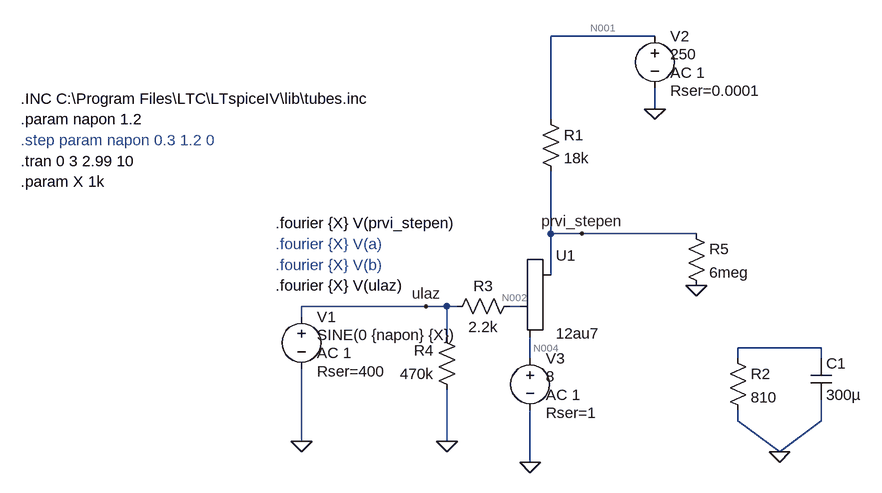
[diagram p0: schematic prvi_etepen.asc]
prvi_etepen.asc, the LTspice schematic file:
Version 4
SHEET 1 1636 692
WIRE 880 16 720 16
WIRE 880 128 880 96
WIRE 720 144 720 16
WIRE 720 320 720 224
WIRE 768 320 720 320
WIRE 944 320 768 320
WIRE 720 384 720 320
WIRE 528 432 336 432
WIRE 560 432 528 432
WIRE 576 432 560 432
WIRE 672 432 656 432
WIRE 336 448 336 432
WIRE 560 480 560 432
WIRE 1136 496 1008 496
WIRE 688 512 688 480
WIRE 1008 512 1008 496
WIRE 1136 512 1136 496
WIRE 1008 608 1008 592
WIRE 1136 608 1136 576
WIRE 336 640 336 528
WIRE 560 640 560 560
WIRE 1072 656 1008 608
WIRE 1072 656 1136 608
WIRE 688 672 688 592
FLAG 560 640 0
FLAG 336 640 0
FLAG 528 432 ulaz
FLAG 688 672 0
FLAG 768 320 prvi_stepen
FLAG 880 128 0
FLAG 944 400 0
FLAG 1072 656 0
SYMBOL voltage 336 432 R0
WINDOW 3 24 44 Left 2
WINDOW 123 24 72 Left 2
WINDOW 39 24 100 Left 2
SYMATTR Value SINE(0 {napon} {X})
SYMATTR Value2 AC 1
SYMATTR SpiceLine Rser=400
SYMATTR InstName V1
SYMBOL Misc\\triode 720 432 R0
SYMATTR InstName U1
SYMATTR Value 12au7
SYMBOL res 704 128 R0
SYMATTR InstName R1
SYMATTR Value 18k
SYMBOL res 992 496 R0
SYMATTR InstName R2
SYMATTR Value 810
SYMBOL res 672 416 R90
WINDOW 0 0 56 VBottom 2
WINDOW 3 32 56 VTop 2
SYMATTR InstName R3
SYMATTR Value 2.2k
SYMBOL res 576 576 R180
WINDOW 0 36 76 Left 2
WINDOW 3 36 40 Left 2
SYMATTR InstName R4
SYMATTR Value 470k
SYMBOL cap 1120 512 R0
SYMATTR InstName C1
SYMATTR Value 300µ
SYMBOL voltage 880 0 R0
WINDOW 3 24 44 Left 2
WINDOW 123 24 72 Left 2
WINDOW 39 24 100 Left 2
SYMATTR Value 250
SYMATTR Value2 AC 1
SYMATTR SpiceLine Rser=0.0001
SYMATTR InstName V2
SYMBOL res 928 304 R0
SYMATTR InstName R5
SYMATTR Value 6meg
SYMBOL voltage 688 496 R0
WINDOW 3 24 44 Left 2
WINDOW 123 24 72 Left 2
WINDOW 39 24 100 Left 2
SYMATTR Value 8
SYMATTR Value2 AC 1
SYMATTR SpiceLine Rser=1
SYMATTR InstName V3
TEXT -96 112 Left 2 !.INC C:\\Program Files\\LTC\\LTspiceIV\\lib\\tubes.inc
TEXT 296 336 Left 2 ;.fourier {X} V(a)
TEXT 296 368 Left 2 ;.fourier {X} V(b)
TEXT 296 400 Left 2 !.fourier {X} V(ulaz)
TEXT 296 304 Left 2 !.fourier {X} V(prvi_stepen)
TEXT -96 144 Left 2 !.param napon 1.2
TEXT -96 208 Left 2 !.tran 0 3 2.99 10
TEXT -96 240 Left 2 !.param X 1k
TEXT -96 176 Left 2 ;.step param napon 0.3 1.2 0

The netlist it stands for:
* prvi_etepen.asc
V1 ulaz 0 SINE(0 {napon} {X}) AC 1 Rser=400
XU1 prvi_stepen N002 N004 12au7
R1 N001 prvi_stepen 18k
R2 N003 0 810
R3 N002 ulaz 2.2k
R4 0 ulaz 470k
C1 N003 0 300µ
V2 N001 0 250 AC 1 Rser=0.0001
R5 prvi_stepen 0 6meg
V3 N004 0 8 AC 1 Rser=1
.INC C:\Program Files\LTC\LTspiceIV\lib\tubes.inc
* .fourier {X} V(a)
* .fourier {X} V(b)
.fourier {X} V(ulaz)
.fourier {X} V(prvi_stepen)
.param napon 1.2
.tran 0 3 2.99 10
.param X 1k
* .step param napon 0.3 1.2 0
.backanno
.end

* Results of the author's LTspice run, read from the files saved beside the schematic
* Operating Point, zero values left out:
*   V(ulaz) = 402.9 nV
*   V(prvi_stepen) = 182.4 V
*   V(n004) = 8.004 V
*   V(n002) = 2.62 µV
*   V(n001) = 250 V
*   I(R5) = 30.41 µA
*   I(R3) = 1.008 nA
*   I(R1) = 3.753 mA
*   I(V3) = 3.723 mA
*   I(V2) = -3.753 mA
*   I(V1) = 1.007 nA
*   Ix(u1:1) = 3.723 mA
*   Ix(u1:2) = -1.008 nA
*   Ix(u1:3) = -3.723 mA
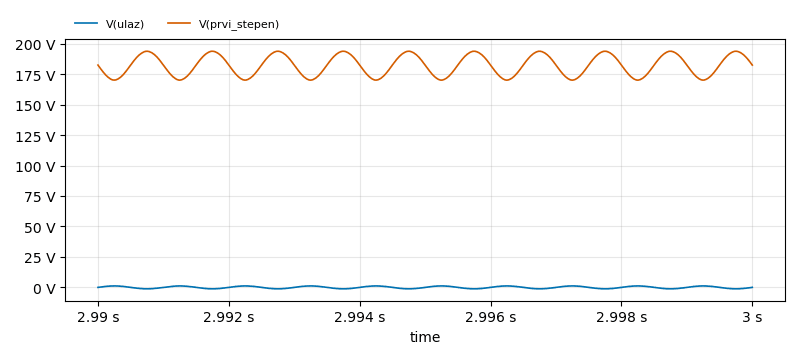
[diagram p1: Transient Analysis of prvi_etepen.asc, plotted from the saved traces]
* Transient Analysis, 1 run:
*   V(ulaz): min -1.196 V, max 1.196 V, average 14.48 µV, rms 839.8 mV, last -92.82 µV
*   V(prvi_stepen): min 170.1 V, max 193.8 V, average 182.2 V, rms 182.4 V, last 182.4 V
* From the log:
*   N-Period=1
*   Fourier components of V(ulaz)
*   DC component:-1.65644e-005
*   Harmonic  Frequency   Fourier   Normalized   Phase    Normalized
*    Number     [Hz]     Component   Component  [degree]  Phase [deg]
*       1     1.000e+03  1.182e+00  1.000e+00      0.01°      0.00°
*       2     2.000e+03  3.282e-05  2.778e-05    -78.18°    -78.19°
*       3     3.000e+03  6.280e-03  5.315e-03   -172.44°   -172.44°
*       4     4.000e+03  3.279e-05  2.775e-05    -56.01°    -56.02°
*       5     5.000e+03  4.292e-03  3.633e-03     11.95°     11.94°
*       6     6.000e+03  3.141e-05  2.659e-05    -39.32°    -39.33°
*       7     7.000e+03  2.310e-03  1.955e-03   -162.03°   -162.04°
*       8     8.000e+03  2.955e-05  2.501e-05    -22.69°    -22.70°
*       9     9.000e+03  9.840e-04  8.329e-04     20.68°     20.67°
*   Total Harmonic Distortion: 0.677970%(0.701506%)
*   N-Period=1
*   Fourier components of V(prvi_stepen)
*   DC component:182.199
*   Harmonic  Frequency   Fourier   Normalized   Phase    Normalized
*    Number     [Hz]     Component   Component  [degree]  Phase [deg]
*       1     1.000e+03  1.171e+01  1.000e+00    179.98°      0.00°
*       2     2.000e+03  2.532e-01  2.162e-02     89.24°    -90.74°
*       3     3.000e+03  6.013e-02  5.134e-03      7.76°   -172.22°
*       4     4.000e+03  4.658e-03  3.977e-04    -79.94°   -259.92°
*       5     5.000e+03  4.245e-02  3.625e-03   -167.91°   -347.89°
*       6     6.000e+03  3.154e-03  2.693e-04    111.20°    -68.78°
*       7     7.000e+03  2.285e-02  1.951e-03     17.66°   -162.32°
*       8     8.000e+03  1.405e-03  1.199e-04    -73.36°   -253.34°
*       9     9.000e+03  9.728e-03  8.306e-04   -158.76°   -338.74°
*   Total Harmonic Distortion: 2.262231%(2.269483%)